# Altium schematic sheet Sheet1.SchDoc
size A4; SheetNumber: 1; SheetTotal: 1
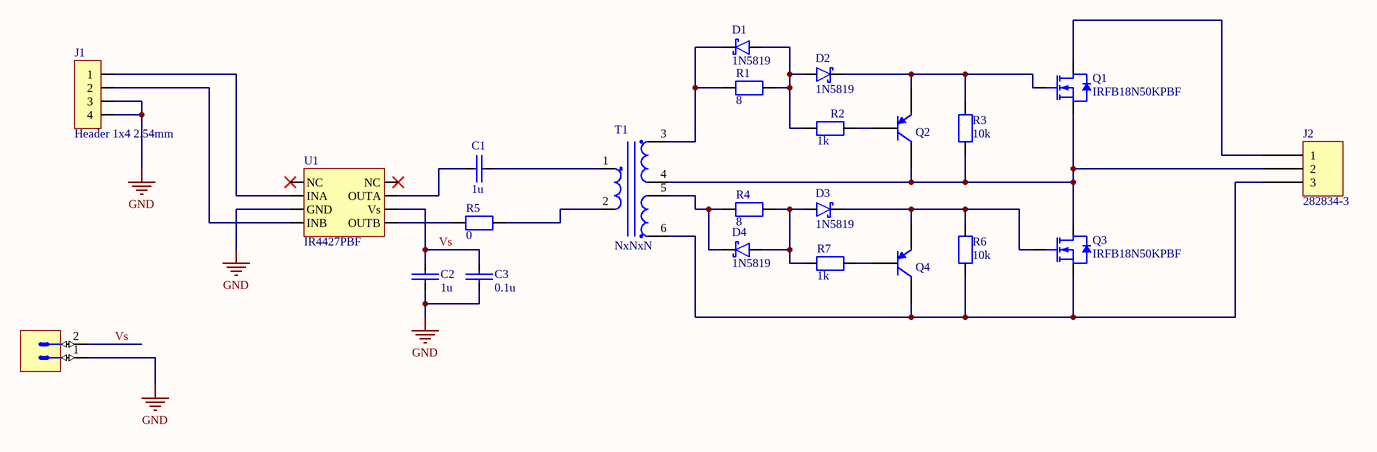
[diagram p0: Sheet1.SchDoc]

## Parts
C1  value 1u  [Cap_THT_0805]  (hidden comment: CAP_THT_0805)
C2  value 1u  [Cap_THT_0805]  (hidden comment: CAP_THT_0805)
C3  value 0.1u  [Cap_THT_0805]  (hidden comment: CAP_THT_0805)
D1  1N5819  [DO-41]
D2  1N5819  [DO-41]
D3  1N5819  [DO-41]
D4  1N5819  [DO-41]
J1  Header 1x4 2.54mm  [Header 1x4 2.54mm]
J2  282834-3  [TE 282834-3]
Q1  IRFB18N50KPBF  [TO-220]
Q2  C2331  [TO-92]  (value not drawn)
Q3  IRFB18N50KPBF  [TO-220]
Q4  C2331  [TO-92]  (value not drawn)
R1  value 8  [RES_0.25W]  (hidden comment: RES)
R2  value 1k  [RES_0.25W]  (hidden comment: RES)
R3  value 10k  [RES_0.25W]  (hidden comment: RES)
R4  value 8  [RES_0.25W]  (hidden comment: RES)
R5  value 0  [RES_0.25W]  (hidden comment: RES)
R6  value 10k  [RES_0.25W]  (hidden comment: RES)
R7  value 1k  [RES_0.25W]  (hidden comment: RES)
T1  NxNxN  [Trans2]
U1  IR4427PBF  [DIP8]
  KK®  [MOLEX_22-27-2021]  (value not drawn)

## Nets
GND: C2.1 C3.1 J1.3 J1.4 U1.3(GND) .1
Vs: C2.2 C3.2 U1.6(Vs) .2
NetC1_1: C1.1 U1.7(OUTA)
NetC1_2: C1.2 T1.1
NetD1_A: D1.A D2.A R1.2 R2.1
NetD1_K: D1.K R1.1 T1.3
NetD2_K: D2.K Q1.G Q2.1(E) R3.2
NetD3_A: D3.A D4.A R4.2 R7.1
NetD3_K: D3.K Q3.G Q4.1(E) R6.2
NetD4_K: D4.K R4.1 T1.5
NetJ1_1: J1.1 U1.2(INA)
NetJ1_2: J1.2 U1.4(INB)
NetJ2_1: J2.1 Q1.D
NetJ2_2: J2.2 Q1.S Q2.2(C) Q3.D R3.1 T1.4
NetJ2_3: J2.3 Q3.S Q4.2(C) R6.1 T1.6
NetQ2_3: Q2.3(B) R2.2
NetQ4_3: Q4.3(B) R7.2
NetR5_1: R5.1 U1.5(OUTB)
NetR5_2: R5.2 T1.2

Not connected (* = marked no-connect by the designer): U1 1(NC)* 8(NC)*

## Library data of the parts
J1 = Header 1x4
J2 = 282834-3: TERM BLK 3P SIDE ENT 2.54MM PCB; Manufacturer: TE Connectivity AMP Connectors; Current: 10A; Mating Orientation: Horizontal with Board; Number of Levels: 1; Pitch: 0.100" (2.54mm); Positions Per Level: 3; Voltage: 150V; Wire Gauge: 16-30 AWG; Wire Termination: Screw - Rising Cage Clamp; Part Number: 282834-3; Color: Green; ComponentLink1Description: Datasheet; ComponentLink1URL: https://www.te.com/commerce/DocumentDelivery/DDEController?Action=srchrtrv&DocNm=282834&DocType=Customer+Drawing&DocLang=English; ComponentLink2Description: DigiKey Link; ComponentLink2URL: http://digikey.com/product-detail/en/te-connectivity-amp-connectors/282834-3/A98334-ND/1153264; LastUpdated: 15.01.2020 4:15:50; Lifecycle Status: Active; Minimum Order: 1; Mounting Type: Through Hole; Packaging: Bulk; Part Status: Active; Price: 2.01; Series: Buchanan; Supplier 1: DigiKey; Supplier Part Number 1: A98334-ND
Q1 Q3 = NMOS: N-channel mosfet transistor; Source: *
T1 = Transformer 1x2
 = MOLEX_22-27-2021: Connector 2 Male; Part Description: 2.54mm (.100") Pitch KK® Wire-to-Board Header, Vertical, with Friction Lock, 2 Circuits, Tin (Sn) Plating; Manufacturer: MOLEX; PressFit: No; Part Number: MOLEX_22-27-2021; Component Kind: Standard; Component Type: Standard; Pin Count: 2; Family: KK®; Mounted: Yes; Socket: No; SMD: No; Sense: No; Status: None; Manufacturer Part Number: 22-27-2021; ComponentHeight: 11.7mm; HelpURL: \\cern.ch\dfs\Applications\Altium\Datasheets\MOLEX_22-27-2021.pdf; Author: CERN DEM JLC; CreateDate: 04.12.2008; LatestRevisionDate: 04.12.2008